# EAGLE schematic pt2399_delay (EAGLE 9.0.0)
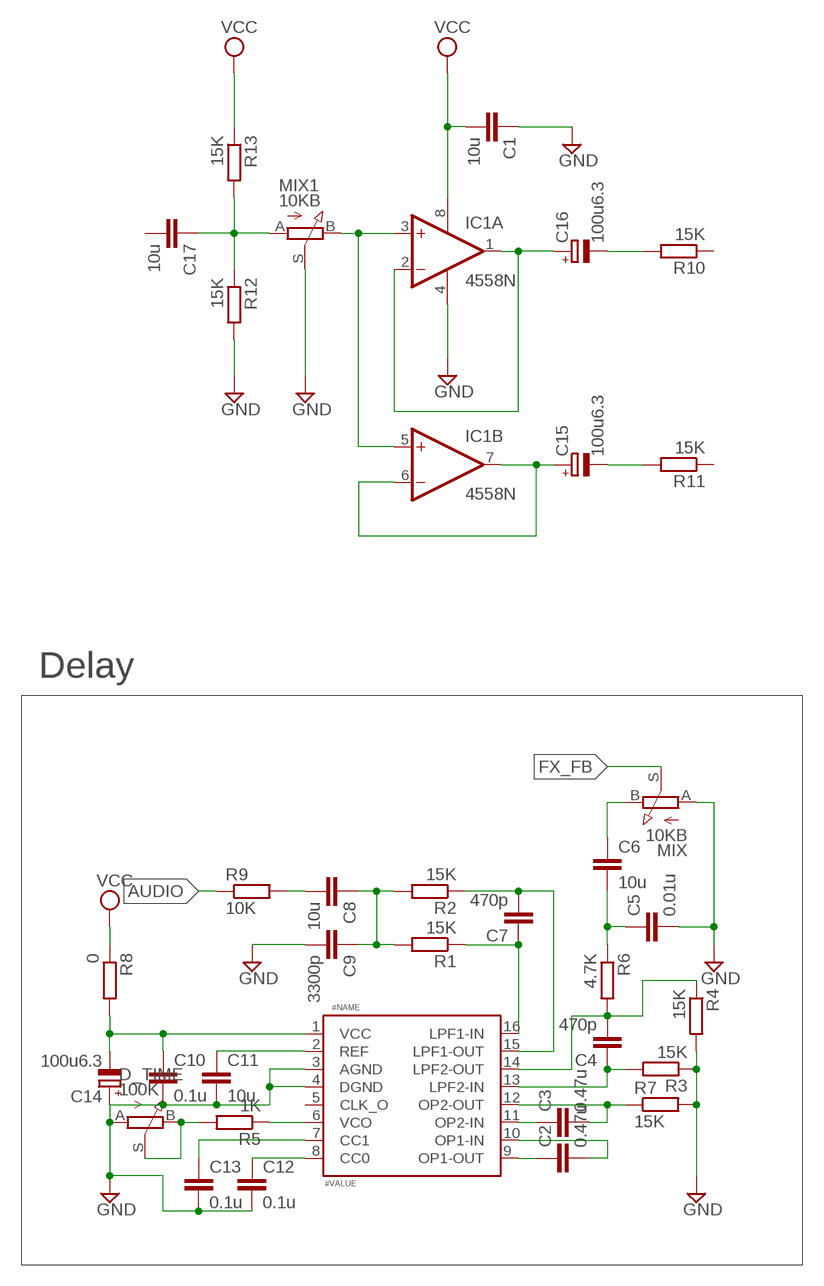
[diagram p0: schematic, sheet 1]

## Parts
C1  10u  C-EUC0805K  [C0805K]
C2  0.47u  C-EUC0805K  [C0805K]
C3  0.47u  C-EUC0805K  [C0805K]
C4  470p  C-EUC0805K  [C0805K]
C5  0.01u  C-EUC0805K  [C0805K]
C6  10u  C-EUC0805K  [C0805K]
C7  470p  C-EUC0805K  [C0805K]
C8  10u  C-EUC0805K  [C0805K]
C9  3300p  C-EUC0805K  [C0805K]
C10  0.1u  C-EUC0805K  [C0805K]
C11  10u  C-EUC0805K  [C0805K]
C12  0.1u  C-EUC0805K  [C0805K]
C13  0.1u  C-EUC0805K  [C0805K]
C14  100u6.3  CPOL-EUTAP5-45  [TAP5-45]
C15  100u6.3  CPOL-EUTAP5-45  [TAP5-45]
C16  100u6.3  CPOL-EUTAP5-45  [TAP5-45]
C17  10u  C-EUC0805K  [C0805K]
D_TIME  100K  RK09K113  [RK09K113]
IC1  4558N  [DIP08]
MIX  10KB  RK09K113  [RK09K113]
MIX1  10KB  RK09K113  [RK09K113]
R1  15K  RESISTOR2012/0805  [2012/0805(1/8)]
R2  15K  RESISTOR2012/0805  [2012/0805(1/8)]
R3  15K  RESISTOR2012/0805  [2012/0805(1/8)]
R4  15K  RESISTOR2012/0805  [2012/0805(1/8)]
R5  1K  RESISTOR2012/0805  [2012/0805(1/8)]
R6  4.7K  RESISTOR2012/0805  [2012/0805(1/8)]
R7  15K  RESISTOR2012/0805  [2012/0805(1/8)]
R8  0  RESISTOR2012/0805  [2012/0805(1/8)]
R9  10K  RESISTOR2012/0805  [2012/0805(1/8)]
R10  15K  RESISTOR2012/0805  [2012/0805(1/8)]
R11  15K  RESISTOR2012/0805  [2012/0805(1/8)]
R12  15K  RESISTOR2012/0805  [2012/0805(1/8)]
R13  15K  RESISTOR2012/0805  [2012/0805(1/8)]
U1  PT2399  [DIL16]

## Nets
AUDIO: R9.1
FX_FB: MIX.S
GND: C1.1 C5.2 C9.2 C10.2 C11.2 C12.2 C13.2 C14.+ D_TIME.A IC1.4(P:V-) MIX1.S MIX.A R3.1 R4.2 R7.2 R12.2 U1.3(AGND) U1.4(DGND)
N$1: C11.1 U1.2(REF)
N$2: C4.2 R4.1 R6.2 U1.14(LPF2-OUT)
N$3: C10.1 C14.- R8.2 U1.1(VCC)
N$4: D_TIME.B(E) D_TIME.S R5.2
N$5: R5.1 U1.6(VCO)
N$6: C5.1 C6.2 R6.1
N$7: C13.1 U1.7(CC1)
N$8: C12.1 U1.8(CC0)
N$9: C8.2 R9.2
N$10: C2.1 U1.9(OP1-OUT)
N$11: C2.2 U1.10(OP1-IN)
N$12: C3.1 U1.11(OP2-IN)
N$13: C3.2 R7.1 U1.12(OP2-OUT)
N$14: C7.1 R1.1 U1.16(LPF1-IN)
N$15: C4.1 R3.2 U1.13(LPF2-IN)
N$16: C6.1 MIX.B(E)
N$17: C17.1 MIX1.A R12.1 R13.2
N$20: C7.2 R2.1 U1.15(LPF1-OUT)
N$21: C8.1 C9.1 R1.2 R2.2
N$23: IC1.3(A:+IN) IC1.5(B:+IN) MIX1.B(E)
N$24: C16.+ IC1.1(A:OUT) IC1.2(A:-IN)
N$25: C16.- R10.2
N$26: C15.+ IC1.6(B:-IN) IC1.7(B:OUT)
N$27: C15.- R11.2
VCC: C1.2 IC1.8(P:V+) R8.1 R13.1
Unconnected: C17.2 R10.1 R11.1 U1.5(CLK_O)

## Notes on the sheet
- Delay

## Library data of the parts
C1-C13 C17 = Capasitor:C-EU: CAPACITOR, European symbol
C14-C16 = Capasitor:CPOL-EU: POLARIZED CAPACITOR, European symbol
D_TIME MIX MIX1 = alps-potentiometers:RK09K113: Alps RK09K113 Series. Single Unit. Vertical Type. Snap In Print Montage Supplier www.reichelt.de datasheet <http://www.alps.com/WebObjects/catalog.woa/E/PDF/Potentiometer/InsulatedShaft/RK09K/RK09K.PDF> Author M.Ebel xebo87@gmail.com Discussion <http://www.mikrocontroller.net/topic/331595>
IC1 = OPAMP:*4558: NJM4558M ・動作電圧：±４～±１８Ｖ ・高利得：１００ｄＢ ｔｙｐ． ・高入力抵抗：５ＭΩ ｔｙｐ． ・バイポーラ構造 ・パッケージ：ＳＳＯＰ８ピン Source: DataSheet <http://akizukidenshi.com/download/ds/jrc/NJM4558.pdf>
R1-R13 = Resistor:RESISTOR: RESISTOR, European symbol
U1 = PT2399:PT2399: PT2399 Delay